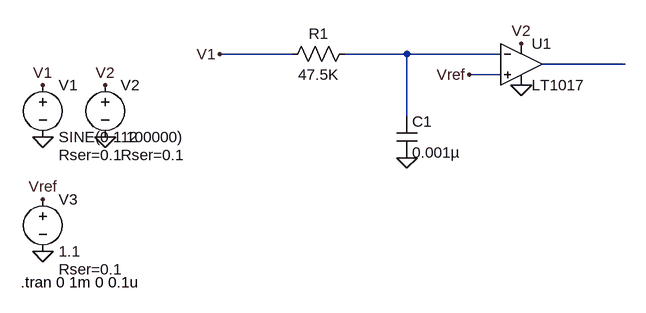
[diagram p0: schematic Impedance.asc]
Impedance.asc, the LTspice schematic file:
Version 4
SHEET 1 880 680
WIRE 96 144 -16 144
WIRE 272 144 176 144
WIRE 416 144 272 144
WIRE 608 160 480 160
WIRE 416 176 368 176
WIRE 272 240 272 144
FLAG 448 192 0
FLAG 272 304 0
FLAG -288 272 0
FLAG -288 192 V1
FLAG -16 144 V1
FLAG -192 192 V2
FLAG 448 128 V2
FLAG -192 272 0
FLAG -288 448 0
FLAG -288 368 Vref
FLAG 368 176 Vref
SYMBOL res 80 160 R270
WINDOW 0 32 56 VTop 2
WINDOW 3 0 56 VBottom 2
SYMATTR InstName R1
SYMATTR Value 47.5K
SYMATTR SpiceLine tol=1 pwr=0.1
SYMBOL cap 256 240 R0
SYMATTR InstName C1
SYMATTR Value 0.001µ
SYMATTR SpiceLine V=50 Irms=75.3m Rser=2.89088 Lser=0 mfg="KEMET" pn="C1206C102K5RAC" type="X7R"
SYMBOL Comparators\\LT1017 448 160 R0
SYMATTR InstName U1
SYMBOL voltage -288 176 R0
WINDOW 123 0 0 Left 2
WINDOW 39 24 124 Left 2
SYMATTR InstName V1
SYMATTR Value SINE(0 1 100000)
SYMATTR SpiceLine Rser=0.1
SYMBOL voltage -192 176 R0
WINDOW 123 0 0 Left 2
WINDOW 39 24 124 Left 2
SYMATTR InstName V2
SYMATTR Value 12
SYMATTR SpiceLine Rser=0.1
SYMBOL voltage -288 352 R0
WINDOW 123 0 0 Left 2
WINDOW 39 24 124 Left 2
SYMATTR InstName V3
SYMATTR Value 1.1
SYMATTR SpiceLine Rser=0.1
TEXT -322 496 Left 2 !.tran 0 1m 0 0.1u

The netlist it stands for:
* Impedance.asc
R1 V1 N001 47.5K tol=1 pwr=0.1
C1 N001 0 0.001µ V=50 Irms=75.3m Rser=2.89088 Lser=0 mfg="KEMET" pn="C1206C102K5RAC" type="X7R"
XU1 Vref N001 V2 0 N002 LT1017  ; pins In+ In- V+ V- OUT
V1 V1 0 SINE(0 1 100000) Rser=0.1
V2 V2 0 12 Rser=0.1
V3 Vref 0 1.1 Rser=0.1
.tran 0 1m 0 0.1u
.backanno
.end